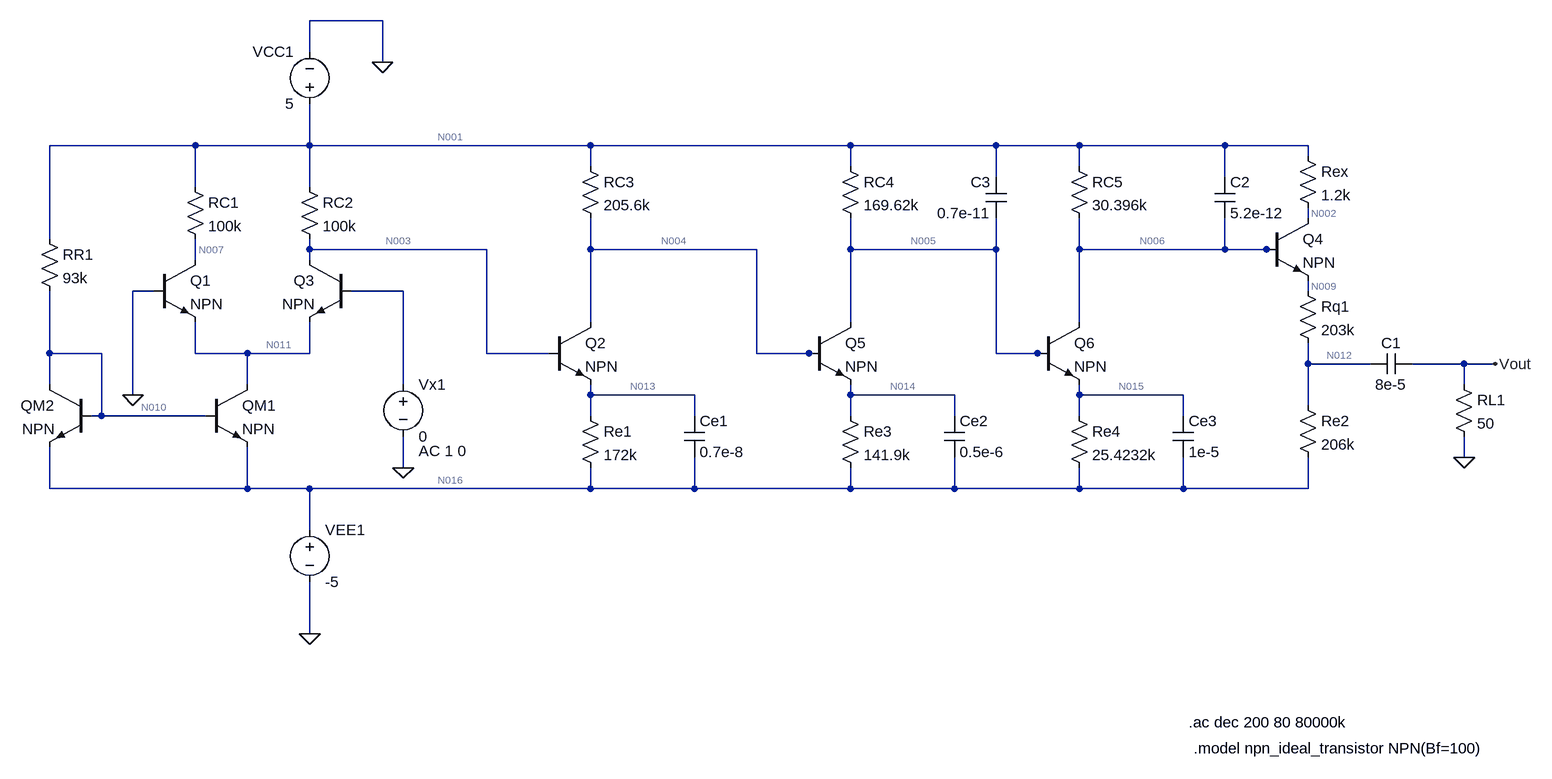
[diagram p0: schematic Rin.asc]
Rin.asc, the LTspice schematic file:
Version 4
SHEET 1 1892 832
WIRE 112 -432 0 -432
WIRE 0 -384 0 -432
WIRE 112 -368 112 -432
WIRE -176 -240 -400 -240
WIRE 0 -240 0 -304
WIRE 0 -240 -176 -240
WIRE 432 -240 0 -240
WIRE 832 -240 432 -240
WIRE 1056 -240 832 -240
WIRE 1184 -240 1056 -240
WIRE 1408 -240 1184 -240
WIRE 1536 -240 1408 -240
WIRE 1536 -224 1536 -240
WIRE 432 -208 432 -240
WIRE 832 -208 832 -240
WIRE 1184 -208 1184 -240
WIRE 1056 -192 1056 -240
WIRE 1408 -192 1408 -240
WIRE -176 -176 -176 -240
WIRE 0 -176 0 -240
WIRE 1536 -128 1536 -144
WIRE -400 -96 -400 -240
WIRE 0 -80 0 -96
WIRE 272 -80 0 -80
WIRE 432 -80 432 -128
WIRE 688 -80 432 -80
WIRE 832 -80 832 -128
WIRE 1056 -80 1056 -128
WIRE 1056 -80 832 -80
WIRE 1184 -80 1184 -128
WIRE 1408 -80 1408 -128
WIRE 1408 -80 1184 -80
WIRE 1472 -80 1408 -80
WIRE 1488 -80 1472 -80
WIRE -176 -64 -176 -96
WIRE 0 -64 0 -80
WIRE -240 -16 -272 -16
WIRE 144 -16 64 -16
WIRE 1536 -16 1536 -32
WIRE 432 32 432 -80
WIRE 832 32 832 -80
WIRE 1184 32 1184 -80
WIRE -400 80 -400 -16
WIRE -320 80 -400 80
WIRE -176 80 -176 32
WIRE -96 80 -176 80
WIRE 0 80 0 32
WIRE 0 80 -96 80
WIRE 272 80 272 -80
WIRE 368 80 272 80
WIRE 688 80 688 -80
WIRE 768 80 688 80
WIRE 784 80 768 80
WIRE 1056 80 1056 -80
WIRE 1120 80 1056 80
WIRE 1136 80 1120 80
WIRE 1536 96 1536 64
WIRE 1632 96 1536 96
WIRE 1776 96 1696 96
WIRE 1824 96 1776 96
WIRE -400 128 -400 80
WIRE -96 128 -96 80
WIRE 144 128 144 -16
WIRE 1776 128 1776 96
WIRE -272 144 -272 -16
WIRE 432 144 432 128
WIRE 592 144 432 144
WIRE 832 144 832 128
WIRE 992 144 832 144
WIRE 1184 144 1184 128
WIRE 1344 144 1184 144
WIRE 1536 160 1536 96
WIRE -320 176 -320 80
WIRE -320 176 -336 176
WIRE -160 176 -320 176
WIRE 432 176 432 144
WIRE 592 176 592 144
WIRE 832 176 832 144
WIRE 992 176 992 144
WIRE 1184 176 1184 144
WIRE 1344 176 1344 144
WIRE 1776 240 1776 208
WIRE 144 256 144 208
WIRE -400 288 -400 224
WIRE -96 288 -96 224
WIRE -96 288 -400 288
WIRE 0 288 -96 288
WIRE 432 288 432 256
WIRE 432 288 0 288
WIRE 592 288 592 240
WIRE 592 288 432 288
WIRE 832 288 832 256
WIRE 832 288 592 288
WIRE 992 288 992 240
WIRE 992 288 832 288
WIRE 1184 288 1184 256
WIRE 1184 288 992 288
WIRE 1344 288 1344 240
WIRE 1344 288 1184 288
WIRE 1536 288 1536 240
WIRE 1536 288 1344 288
WIRE 0 352 0 288
WIRE 0 512 0 432
FLAG 0 512 0
FLAG 112 -368 0
FLAG 144 256 0
FLAG 1776 240 0
FLAG 1824 96 Vout
FLAG -272 144 0
SYMBOL res -192 -192 R0
SYMATTR InstName RC1
SYMATTR Value 100k
SYMBOL res -16 -192 R0
SYMATTR InstName RC2
SYMATTR Value 100k
SYMBOL Res 416 160 R0
SYMATTR InstName Re1
SYMATTR Value 172k
SYMBOL Res -416 -112 R0
SYMATTR InstName RR1
SYMATTR Value 93k
SYMBOL Res 416 -224 R0
SYMATTR InstName RC3
SYMATTR Value 205.6k
SYMBOL npn -240 -64 R0
SYMATTR InstName Q1
SYMBOL npn 368 32 R0
SYMATTR InstName Q2
SYMBOL npn -160 128 R0
SYMATTR InstName QM1
SYMBOL npn -336 128 M0
SYMATTR InstName QM2
SYMBOL npn 64 -64 M0
SYMATTR InstName Q3
SYMBOL voltage 0 336 R0
SYMATTR InstName VEE1
SYMATTR Value -5
SYMBOL voltage 0 -288 R180
WINDOW 0 24 96 Left 2
WINDOW 3 24 16 Left 2
SYMATTR InstName VCC1
SYMATTR Value 5
SYMBOL voltage 144 112 R0
WINDOW 123 24 118 Left 2
WINDOW 39 24 140 Left 2
SYMATTR Value2 AC 1 0
SYMATTR InstName Vx1
SYMATTR Value 0
SYMBOL cap 576 176 R0
SYMATTR InstName Ce1
SYMATTR Value 0.7e-8
SYMBOL npn 1472 -128 R0
SYMATTR InstName Q4
SYMBOL Res 1520 144 R0
SYMATTR InstName Re2
SYMATTR Value 206k
SYMBOL Res 1760 112 R0
SYMATTR InstName RL1
SYMATTR Value 50
SYMBOL cap 1696 80 R90
WINDOW 0 0 32 VBottom 2
WINDOW 3 32 32 VTop 2
SYMATTR InstName C1
SYMATTR Value 8e-5
SYMBOL Res 816 160 R0
SYMATTR InstName Re3
SYMATTR Value 141.9k
SYMBOL Res 816 -224 R0
SYMATTR InstName RC4
SYMATTR Value 169.62k
SYMBOL npn 768 32 R0
SYMATTR InstName Q5
SYMBOL cap 976 176 R0
SYMATTR InstName Ce2
SYMATTR Value 0.5e-6
SYMBOL Res 1520 -32 R0
SYMATTR InstName Rq1
SYMATTR Value 203k
SYMBOL Res 1168 160 R0
SYMATTR InstName Re4
SYMATTR Value 25.4232k
SYMBOL Res 1168 -224 R0
SYMATTR InstName RC5
SYMATTR Value 30.396k
SYMBOL npn 1120 32 R0
SYMATTR InstName Q6
SYMBOL cap 1328 176 R0
SYMATTR InstName Ce3
SYMATTR Value 1e-5
SYMBOL cap 1392 -192 R0
SYMATTR InstName C2
SYMATTR Value 5.2e-12
SYMBOL cap 1072 -128 R180
WINDOW 0 24 56 Left 2
WINDOW 3 24 8 Left 2
SYMATTR InstName C3
SYMATTR Value 0.7e-11
SYMBOL Res 1520 -240 R0
SYMATTR InstName Rex
SYMATTR Value 1.2k
TEXT 1352 648 Left 2 !.ac dec 200 80 80000k
TEXT 1360 688 Left 2 !.model npn_ideal_transistor NPN(Bf=100)

The netlist it stands for:
* Rin.asc
RC1 N001 N007 100k
RC2 N001 N003 100k
Re1 N013 N016 172k
RR1 N001 N010 93k
RC3 N001 N004 205.6k
Q1 N007 0 N011 0 NPN
Q2 N004 N003 N013 0 NPN
QM1 N011 N010 N016 0 NPN
QM2 N010 N010 N016 0 NPN
Q3 N003 N008 N011 0 NPN
VEE1 N016 0 -5
VCC1 N001 0 5
Vx1 N008 0 0 AC 1 0
Ce1 N013 N016 0.7e-8
Q4 N002 N006 N009 0 NPN
Re2 N012 N016 206k
RL1 Vout 0 50
C1 Vout N012 8e-5
Re3 N014 N016 141.9k
RC4 N001 N005 169.62k
Q5 N005 N004 N014 0 NPN
Ce2 N014 N016 0.5e-6
Rq1 N009 N012 203k
Re4 N015 N016 25.4232k
RC5 N001 N006 30.396k
Q6 N006 N005 N015 0 NPN
Ce3 N015 N016 1e-5
C2 N001 N006 5.2e-12
C3 N005 N001 0.7e-11
Rex N001 N002 1.2k
.model NPN NPN
.model PNP PNP
.lib standard.bjt
.ac dec 200 80 80000k
.model npn_ideal_transistor NPN(Bf=100)
.backanno
.end

* Results of the author's LTspice run, read from the files saved beside the schematic
* Operating Point, zero values left out:
*   V(n001) = 5 V
*   V(n007) = 153.9 mV
*   V(n003) = 128 mV
*   V(n013) = -551.5 mV
*   V(n016) = -5 V
*   V(n010) = -4.286 V
*   V(n004) = -321.5 mV
*   V(n011) = -695.9 mV
*   V(n002) = 4.988 V
*   V(n006) = -46.55 mV
*   V(n009) = -702.7 mV
*   V(n012) = -2.836 V
*   V(n014) = -1.003 V
*   V(n005) = -11.76 mV
*   V(n015) = -739.5 mV
*   Ic(Q6) = 165.9 µA
*   Ib(Q6) = 1.659 µA
*   Ie(Q6) = -167.6 µA
*   Ic(Q5) = 27.89 µA
*   Ib(Q5) = 278.9 nA
*   Ie(Q5) = -28.17 µA
*   Ic(Q4) = 10.4 µA
*   Ib(Q4) = 104 nA
*   Ie(Q4) = -10.51 µA
*   Ic(Q3) = 48.46 µA
*   Ib(Q3) = 484.6 nA
*   Ie(Q3) = -48.95 µA
*   Ic(Qm2) = 97.89 µA
*   Ib(Qm2) = 978.9 nA
*   Ie(Qm2) = -98.87 µA
*   Ic(Qm1) = 97.89 µA
*   Ib(Qm1) = 978.9 nA
*   Ie(Qm1) = -98.87 µA
*   Ic(Q2) = 25.6 µA
*   Ib(Q2) = 259.6 nA
*   Ie(Q2) = -25.86 µA
*   Ic(Q1) = 48.46 µA
*   Ib(Q1) = 484.6 nA
*   Ie(Q1) = -48.95 µA
*   I(Rex) = 10.4 µA
*   I(Rc5) = 166 µA
*   I(Re4) = 167.6 µA
*   I(Rq1) = 10.51 µA
*   I(Rc4) = 29.55 µA
*   I(Re3) = 28.17 µA
*   I(Re2) = 10.51 µA
*   I(Rc3) = 25.88 µA
*   I(Rr1) = 99.85 µA
*   I(Re1) = 25.86 µA
*   I(Rc2) = 48.72 µA
*   I(Rc1) = 48.46 µA
*   I(Vx1) = -484.6 nA
*   I(Vcc1) = -428.9 µA
*   I(Vee1) = 429.9 µA
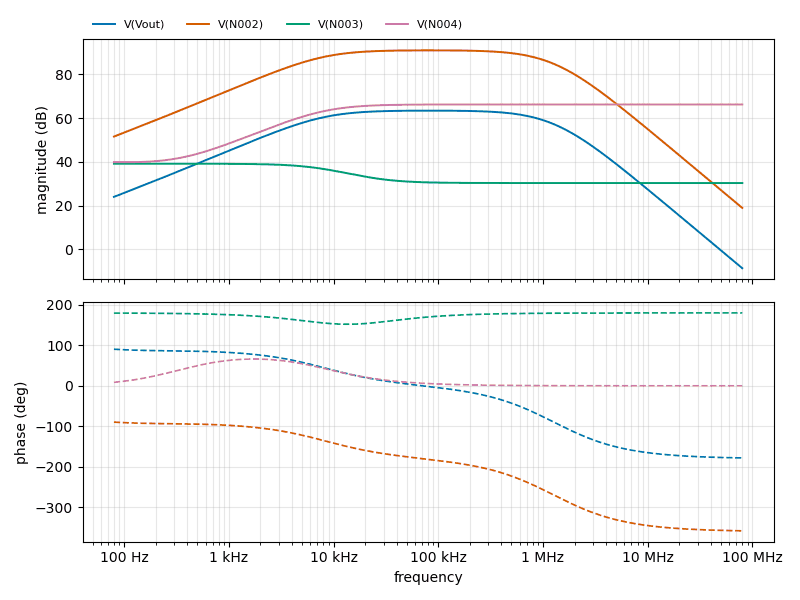
[diagram p1: AC Analysis of Rin.asc, plotted from the saved traces]
* AC Analysis, 1 run:
*   V(Vout): 24.01 dB at 80 Hz, -8.55 dB at 80 MHz, peak 63.38 dB at 83.77 kHz, 3 dB below the peak at 8.063 kHz and 799.4 kHz
*   V(N002): 51.53 dB at 80 Hz, 18.97 dB at 80 MHz, peak 90.90 dB at 83.77 kHz, 3 dB below the peak at 8.063 kHz and 799.4 kHz
*   V(N003): 39.14 dB at 80 Hz, 30.33 dB at 80 MHz, peak 39.14 dB at 196.4 Hz, 3 dB below the peak at 9.583 kHz
*   V(N004): 39.82 dB at 80 Hz, 66.20 dB at 80 MHz, peak 66.20 dB at 80 MHz, 3 dB below the peak at 8.203 kHz